# Altium schematic sheet POWER.SchDoc
size A4; SheetNumber: 5; SheetTotal: 5
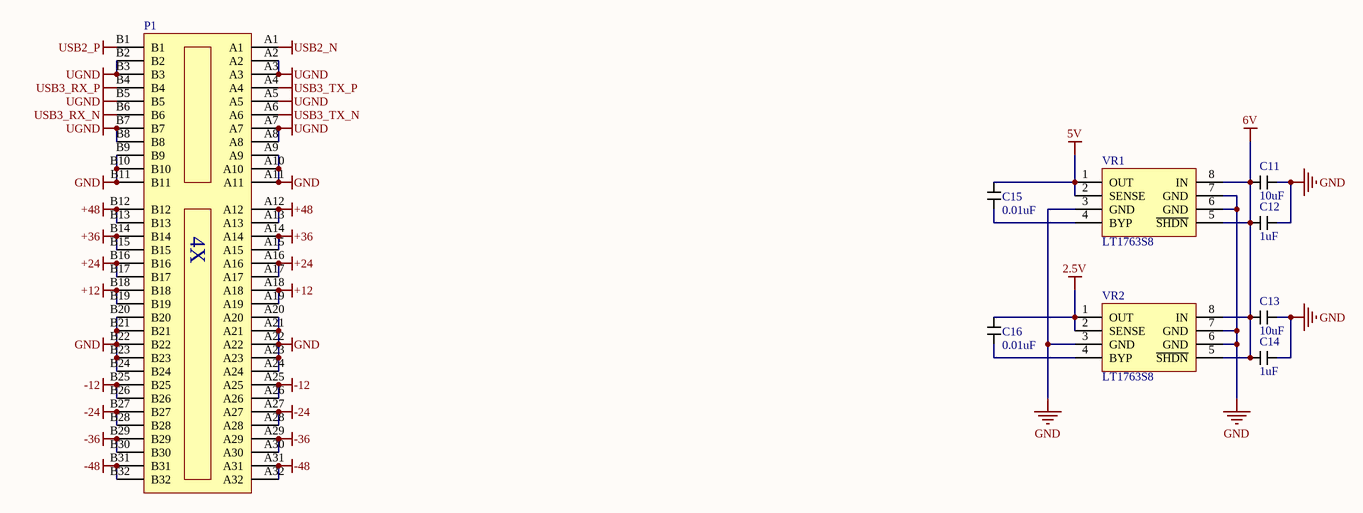
[diagram p0: POWER.SchDoc]

## Parts
C11  10uF  [C0805]
C12  1uF  [C0805]
C13  10uF  [C0805]
C14  1uF  [C0805]
C15  0.01uF  [C0805]
C16  0.01uF  [C0805]
P1  10018783-10201TLF  [PCIe4X]  (value not drawn)
VR1  LT1763S8  [SOIC-8]
VR2  LT1763S8  [SOIC-8]

## Nets
2.5V: C16.1 VR2.1(OUT) VR2.2(SENSE)
5V: C15.1 VR1.1(OUT) VR1.2(SENSE)
6V: C11.2 C12.2 C13.2 C14.2 VR1.5(~{SHDN}) VR1.8(IN) VR2.5(~{SHDN}) VR2.8(IN)
+12: P1.A18 P1.A19 P1.B18 P1.B19
+24: P1.A16 P1.A17 P1.B16 P1.B17
+36: P1.A14 P1.A15 P1.B14 P1.B15
+48: P1.A12 P1.A13 P1.B12 P1.B13
-12: P1.A25 P1.A26 P1.B25 P1.B26
-24: P1.A27 P1.A28 P1.B27 P1.B28
-36: P1.A29 P1.A30 P1.B29 P1.B30
-48: P1.A31 P1.A32 P1.B31 P1.B32
GND: C11.1 C12.1 C13.1 C14.1 P1.A9 P1.A10 P1.A11 P1.A20 P1.A21 P1.A22 P1.A23 P1.A24 P1.B9 P1.B10 P1.B11 P1.B20 P1.B21 P1.B22 P1.B23 P1.B24 VR1.3(GND) VR1.6(GND) VR1.7(GND) VR2.3(GND) VR2.6(GND) VR2.7(GND)
UGND: P1.A2 P1.A3 P1.A5 P1.A7 P1.A8 P1.B2 P1.B3 P1.B5 P1.B7 P1.B8
USB2_N: P1.A1
USB2_P: P1.B1
USB3_RX_N: P1.B6
USB3_RX_P: P1.B4
USB3_TX_N: P1.A6
USB3_TX_P: P1.A4
NetC15_2: C15.2 VR1.4(BYP)
NetC16_2: C16.2 VR2.4(BYP)

## Notes on the sheet
- (in symbol 10018783-10201TLF) 4X

## Library data of the parts
C11-C16 = C0805
  C11 C13: Capacitance: 10uF
  C12 C14: Capacitance: 1uF
  C15 C16: Capacitance: 0.01uF
P1 = 10018783-10201TLF: PCIe 4x; Supplier 1: Digi-Key; Supplier Part Number 1: 609-1964-ND